# Altium schematic sheet USB.SchDoc
size A
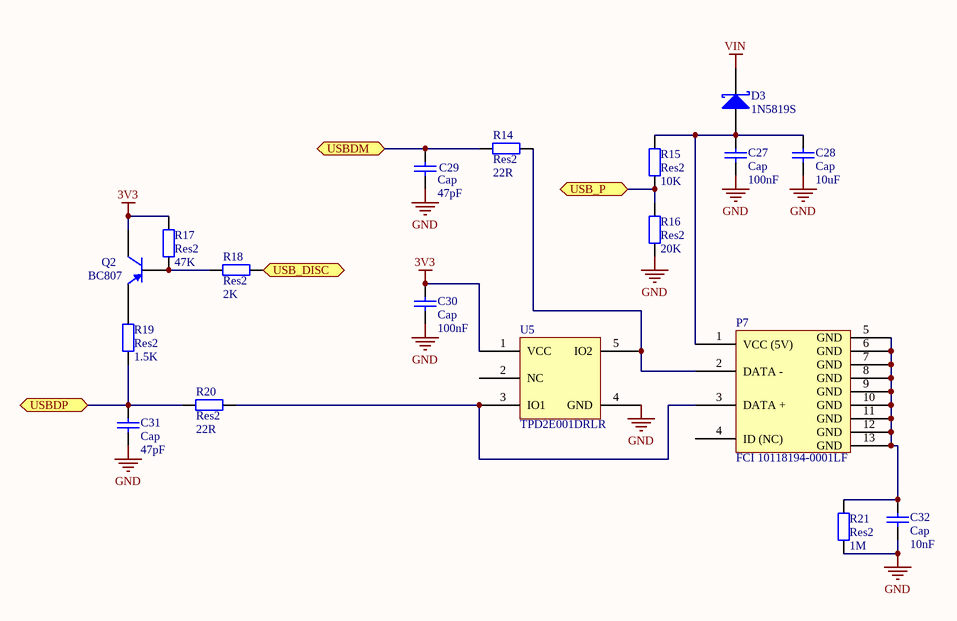
[diagram p0: USB.SchDoc]

## Parts
C27  Cap  value 100nF  [0603]
C28  Cap  value 10uF  [0805]
C29  Cap  value 47pF  [0603]
C30  Cap  value 100nF  [0603]
C31  Cap  value 47pF  [0603]
C32  Cap  value 10nF  [0603]
D3  1N5819S  [SMB]
P7  FCI 10118194-0001LF  [CONN USB MICRO B RECPT SMT R/A]
Q2  BC807  [SOT-23B_L]
R14  Res2  value 22R  [0603]
R15  Res2  value 10K  [0603]
R16  Res2  value 20K  [0603]
R17  Res2  value 47K  [0603]
R18  Res2  value 2K  [0603]
R19  Res2  value 1.5K  [0603]
R20  Res2  value 22R  [0603]
R21  Res2  value 1M  [0603]
U5  TPD2E001DRLR  [SOT-553]

## Ports
USB_DISC, USB_P, USBDM, USBDP

## Nets
3V3: C30.2 Q2.1(C) R17.1 U5.1(VCC)
GND: C27.1 C28.1 C29.1 C30.1 C31.1 C32.1 R16.1 R21.2 U5.4(GND)
VIN: D3.2(K)
USB_DISC: R18.2 ; port USB_DISC
USB_P: R15.1 R16.2 ; port USB_P
USBDM: C29.2 R14.2 ; port USBDM
USBDP: C31.2 R19.2 R20.2 ; port USBDP
NetC27_2: C27.2 C28.2 D3.1(A) P7.1(VCC_(5V)) R15.2
NetC32_2: C32.2 P7.5(GND) P7.6(GND) P7.7(GND) P7.8(GND) P7.9(GND) P7.10(GND) P7.11(GND) P7.12(GND) P7.13(GND) R21.1
NetP7_2: P7.2(DATA_-) R14.1 U5.5(IO2)
NetP7_3: P7.3(DATA_+) R20.1 U5.3(IO1)
NetQ2_2: Q2.2(B) R17.2 R18.1
NetQ2_3: Q2.3(E) R19.1

Not connected (* = marked no-connect by the designer): P7 4(ID_(NC)); U5 2(NC)

## Library data of the parts
C27 C28 C30 = Cap: Capacitor; Supplier 1: Digi-Key
  C27 C30: Supplier Part Number 1: 399-1095-1-ND
  C28: Supplier Part Number 1: 445-6857-1-ND
C29 C31 = Cap: Capacitor; Manufacturer: Samsung Electro-Mechanics America, Inc; Manufacturer Part Number: CL10C470JB8NCNC; Description: CAP CER 47PF 50V 5% NP0 0603; Tolerance: ±5%; Voltage - Rated: 50V; Temperature Coefficient: C0G, NP0; Supplier 1: Digi-Key; Supplier Part Number 1: 1276-2296-1-ND; RoHS: RoHS Compliant; Category: Capacitors; Stock 1: 191448; Pricing 1: 1=0.1, 10=0.029, 25=0.0204, 100=0.0132, 500=0.00924, 1000=0.0072 (USD); Packaging: Cut Tape (CT); Capacitance: 47pF; Mounting Type: Surface Mount, MLCC; Operating Temperature: -55°C ~ 125°C; Applications: General Purpose; Ratings: -; Package / Case: 0603 (1608 Metric); Size / Dimension: 0.063" L x 0.031" W (1.60mm x 0.80mm); Height - Seated (Max): -; Thickness (Max): 0.035" (0.90mm); Lead Spacing: -; Features: -; Lead Style: -; ComponentLink1URL: http://www.samsungsem.com/kr/front/downloadcms.do?path=/kr/support/product-search/mlcc/__icsFiles/afieldfile/2014/11/05&fileName=S_CL10C470JB8NCNC.pdf; ComponentLink1Description: http://www.samsungsem.com/kr/front/downloadcms.do?path=/kr/support/product-search/mlcc/__icsFiles/afieldfile/2014/11/05&fileName=S_CL10C470JB8NCNC.pdf
C32 = Cap: Capacitor; Manufacturer: Samsung Electro-Mechanics America, Inc; Manufacturer Part Number: CL10B103JB8NNNC; Description: CAP CER 10000PF 50V 5% X7R 0603; Capacitance: 10000pF; Tolerance: ±5%; Voltage - Rated: 50V; Temperature Coefficient: X7R; Supplier 1: Digi-Key; Supplier Part Number 1: 1276-1103-1-ND; RoHS: RoHS Compliant; Category: Capacitors; Stock 1: 65936; Pricing 1: 1=0.1, 10=0.036, 25=0.0256, 100=0.0165, 500=0.01156, 1000=0.009 (USD); Packaging: Cut Tape (CT); Mounting Type: Surface Mount, MLCC; Operating Temperature: -55°C ~ 125°C; Applications: General Purpose; Ratings: -; Package / Case: 0603 (1608 Metric); Size / Dimension: 0.063" L x 0.031" W (1.60mm x 0.80mm); Height - Seated (Max): -; Thickness (Max): 0.035" (0.90mm); Lead Spacing: -; Features: -; Lead Style: -; ComponentLink1URL: http://www.samsungsem.com/kr/front/downloadcms.do?path=/kr/support/product-search/mlcc/__icsFiles/afieldfile/2014/11/05&fileName=S_CL10B103JB8NNNC.pdf; ComponentLink1Description: http://www.samsungsem.com/kr/front/downloadcms.do?path=/kr/support/product-search/mlcc/__icsFiles/afieldfile/2014/11/05&fileName=S_CL10B103JB8NNNC.pdf
D3 = D Schottky: Schottky Diode; Manufacturer: Diodes Incorporated; Manufacturer Part Number: 1N5819HW-7-F; Description: DIODE SCHOTTKY 40V 1A SOD123; Voltage - DC Reverse (Vr) (Max): 40V; Current - Average Rectified (Io): 1A; Voltage - Forward (Vf) (Max) @ If: 450mV @ 1A; Speed: Fast Recovery =< 500ns, > 200mA (Io); Current - Reverse Leakage @ Vr: 1mA @ 40V; Capacitance @ Vr, F: 60pF @ 4V, 1MHz; Published: 8-Jun-2000; LatestRevisionDate: 17-Jul-2002; LatestRevisionNote: Re-released for DXP Platform.; PackageReference: SMB; Publisher: Altium Limited; PackageDescription: DO-214-AA/SMB; 2 C-Bend Leads; Body 5.3 x 3.6 mm, inc. leads (LxW); Code_JEDEC: DO-214-AA; Supplier 1: Digi-Key; Supplier Part Number 1: 1N5819HW-FDICT-ND; RoHS: RoHS Compliant; Category: Discrete Semiconductor Products; Stock 1: 628950; Pricing 1: 1=0.52, 10=0.371, 25=0.2884, 100=0.2184, 250=0.1544, 500=0.1236, 1000=0.0948 (USD); Packaging: Cut Tape (CT); Diode Type: Schottky; Reverse Recovery Time (trr): -; Mounting Type: Surface Mount; Package / Case: SOD-123; Supplier Device Package: SOD-123; Operating Temperature - Junction: -65°C ~ 125°C; ComponentLink1URL: http://www.diodes.com/datasheets/ds30217.pdf; ComponentLink1Description: http://www.diodes.com/datasheets/ds30217.pdf
P7 = FCI 10118194-0001LF: CONN USB MICRO B RECPT SMT R/A
Q2 = PNP: PNP Bipolar Transistor; Manufacturer: NXP Semiconductors; Manufacturer Part Number: BC807-40,215; Description: TRANS PNP 45V 0.5A SOT23; Current - Collector (Ic) (Max): 500mA; Voltage - Collector Emitter Breakdown (Max): 45V; Vce Saturation (Max) @ Ib, Ic: 700mV @ 50mA, 500mA; DC Current Gain (hFE) (Min) @ Ic, Vce: 250 @ 100mA, 1V; Power - Max: 250mW; Frequency - Transition: 80MHz; Published: 8-Jun-2000; LatestRevisionDate: 29-May-2009; LatestRevisionNote: IPC-7351 Footprint Added.; PackageVersion: Aug-1999; PackageReference: SOT-23B; Publisher: Altium Limited; PackageDescription: 3-Pin SOT-23 Package 0.95 mm Pitch, 2.4 mm Lead Span; Supplier 1: Digi-Key; Supplier Part Number 1: 568-1629-1-ND; RoHS: RoHS Compliant; Category: Discrete Semiconductor Products; Stock 1: 87848; Pricing 1: 1=0.15, 10=0.133, 25=0.1212, 100=0.0871, 250=0.05132, 500=0.04258, 1000=0.02905 (USD); Packaging: Cut Tape (CT); Transistor Type: PNP; Current - Collector Cutoff (Max): -; Mounting Type: Surface Mount; Package / Case: TO-236-3, SC-59, SOT-23-3; Supplier Device Package: SOT-23 (TO-236AB); ComponentLink1URL: http://www.nxp.com/documents/data_sheet/BC807_BC807W_BC327.pdf; ComponentLink1Description: http://www.nxp.com/documents/data_sheet/BC807_BC807W_BC327.pdf
R14 R20 = Res2: Resistor; Manufacturer: Panasonic Electronic Components; Manufacturer Part Number: ERJ-3EKF22R0V; Description: RES SMD 22 OHM 1% 1/10W 0603; Resistance (Ohms): 22; Tolerance: ±1%; Power (Watts): 0.1W, 1/10W; Temperature Coefficient: ±100ppm/°C; Supplier 1: Digi-Key; Supplier Part Number 1: P22.0HCT-ND; RoHS: RoHS Compliant; Category: Resistors; Stock 1: 210130; Pricing 1: 1=0.1, 50=0.015, 100=0.0114, 250=0.00844, 500=0.00624, 1000=0.00416, 2500=0.00351 (USD); Packaging: Cut Tape (CT); Composition: Thick Film; Features: Automotive AEC-Q200; Operating Temperature: -55°C ~ 155°C; Package / Case: 0603 (1608 Metric); Supplier Device Package: 0603; Size / Dimension: 0.063" L x 0.031" W (1.60mm x 0.80mm); Height: 0.022" (0.55mm); Number of Terminations: 2; ComponentLink1URL: http://industrial.panasonic.com/www-cgi/jvcr13pz.cgi?E+PZ+3+AOA0002+ERJ3EKF22R0V+7+WW; ComponentLink1Description: http://industrial.panasonic.com/www-cgi/jvcr13pz.cgi?E+PZ+3+AOA0002+ERJ3EKF22R0V+7+WW
R15 = Res2: Resistor; Manufacturer: Panasonic Electronic Components; Manufacturer Part Number: ERJ-3GEYJ103V; Description: RES SMD 10K OHM 5% 1/10W 0603; Tolerance: ±5%; Power (Watts): 0.1W, 1/10W; Temperature Coefficient: ±200ppm/°C; Supplier 1: Digi-Key; Supplier Part Number 1: P10KGCT-ND; RoHS: RoHS Compliant; Category: Resistors; Stock 1: 3887859; Pricing 1: 1=0.1, 50=0.0126, 100=0.0096, 250=0.00716, 500=0.00528, 1000=0.00352, 2500=0.00297 (USD); Packaging: Cut Tape (CT); Resistance (Ohms): 10k; Composition: Thick Film; Features: Automotive AEC-Q200; Operating Temperature: -55°C ~ 155°C; Package / Case: 0603 (1608 Metric); Supplier Device Package: 0603; Size / Dimension: 0.063" L x 0.031" W (1.60mm x 0.80mm); Height: 0.022" (0.55mm); Number of Terminations: 2; ComponentLink1URL: http://industrial.panasonic.com/www-cgi/jvcr13pz.cgi?E+PZ+3+AOA0001+ERJ3GEYJ103V+7+WW; ComponentLink1Description: http://industrial.panasonic.com/www-cgi/jvcr13pz.cgi?E+PZ+3+AOA0001+ERJ3GEYJ103V+7+WW
R16 = Res2: Resistor; Manufacturer: Samsung Electro-Mechanics America, Inc; Manufacturer Part Number: RC1608F203CS; Description: RES SMD 20K OHM 1% 1/10W 0603; Tolerance: ±1%; Power (Watts): 0.1W, 1/10W; Temperature Coefficient: ±100ppm/°C; Supplier 1: Digi-Key; Supplier Part Number 1: 1276-4768-1-ND; RoHS: RoHS Compliant; Category: Resistors; Stock 1: 9626; Pricing 1: 1=0.1, 10=0.011, 25=0.0084, 100=0.0047, 500=0.00286, 1000=0.0021, 2500=0.00182 (USD); Packaging: Cut Tape (CT); Resistance (Ohms): 20k; Composition: Thick Film; Features: -; Operating Temperature: -55°C ~ 155°C; Package / Case: 0603 (1608 Metric); Supplier Device Package: 0603 (1608 Metric); Size / Dimension: 0.063" L x 0.031" W (1.60mm x 0.80mm); Height: 0.022" (0.55mm); Number of Terminations: 2; ComponentLink1URL: http://www.samsungsem.com/global/support/library/product-catalog/__icsFiles/afieldfile/2015/01/12/CHIP_RESISTOR_150112_1.pdf; ComponentLink1Description: http://www.samsungsem.com/global/support/library/product-catalog/__icsFiles/afieldfile/2015/01/12/CHIP_RESISTOR_150112_1.pdf
R17 = Res2: Resistor; Manufacturer: Samsung Electro-Mechanics America, Inc; Manufacturer Part Number: RC1608F473CS; Description: RES SMD 47K OHM 1% 1/10W 0603; Tolerance: ±1%; Power (Watts): 0.1W, 1/10W; Temperature Coefficient: ±100ppm/°C; Supplier 1: Digi-Key; Supplier Part Number 1: 1276-4808-1-ND; RoHS: RoHS Compliant; Category: Resistors; Stock 1: 3886; Pricing 1: 1=0.1, 10=0.011, 25=0.0084, 100=0.0047, 500=0.00286, 1000=0.0021, 2500=0.00182 (USD); Packaging: Cut Tape (CT); Resistance (Ohms): 47k; Composition: Thick Film; Features: -; Operating Temperature: -55°C ~ 155°C; Package / Case: 0603 (1608 Metric); Supplier Device Package: 0603 (1608 Metric); Size / Dimension: 0.063" L x 0.031" W (1.60mm x 0.80mm); Height: 0.022" (0.55mm); Number of Terminations: 2; ComponentLink1URL: http://www.samsungsem.com/global/support/library/product-catalog/__icsFiles/afieldfile/2015/01/12/CHIP_RESISTOR_150112_1.pdf; ComponentLink1Description: http://www.samsungsem.com/global/support/library/product-catalog/__icsFiles/afieldfile/2015/01/12/CHIP_RESISTOR_150112_1.pdf
R18 = Res2: Resistor; Manufacturer: Samsung Electro-Mechanics America, Inc; Manufacturer Part Number: RC1608F202CS; Description: RES SMD 2K OHM 1% 1/10W 0603; Tolerance: ±1%; Power (Watts): 0.1W, 1/10W; Temperature Coefficient: ±100ppm/°C; Supplier 1: Digi-Key; Supplier Part Number 1: 1276-3495-1-ND; RoHS: RoHS Compliant; Category: Resistors; Stock 1: 2703; Pricing 1: 1=0.1, 10=0.011, 25=0.0084, 100=0.0047, 500=0.00286, 1000=0.0021, 2500=0.00182 (USD); Packaging: Cut Tape (CT); Resistance (Ohms): 2k; Composition: Thick Film; Features: -; Operating Temperature: -55°C ~ 155°C; Package / Case: 0603 (1608 Metric); Supplier Device Package: 0603 (1608 Metric); Size / Dimension: 0.063" L x 0.031" W (1.60mm x 0.80mm); Height: 0.022" (0.55mm); Number of Terminations: 2; ComponentLink1URL: http://www.samsungsem.com/global/support/library/product-catalog/__icsFiles/afieldfile/2015/01/12/CHIP_RESISTOR_150112_1.pdf; ComponentLink1Description: http://www.samsungsem.com/global/support/library/product-catalog/__icsFiles/afieldfile/2015/01/12/CHIP_RESISTOR_150112_1.pdf
R19 = Res2: Resistor; Manufacturer: Samsung Electro-Mechanics America, Inc; Manufacturer Part Number: RC1608F152CS; Description: RES SMD 1.5K OHM 1% 1/10W 0603; Tolerance: ±1%; Power (Watts): 0.1W, 1/10W; Temperature Coefficient: ±100ppm/°C; Supplier 1: Digi-Key; Supplier Part Number 1: 1276-4660-1-ND; RoHS: RoHS Compliant; Category: Resistors; Stock 1: 40182; Pricing 1: 1=0.1, 10=0.011, 25=0.0084, 100=0.0047, 500=0.00286, 1000=0.0021, 2500=0.00182 (USD); Packaging: Cut Tape (CT); Resistance (Ohms): 1.5k; Composition: Thick Film; Features: -; Operating Temperature: -55°C ~ 155°C; Package / Case: 0603 (1608 Metric); Supplier Device Package: 0603 (1608 Metric); Size / Dimension: 0.063" L x 0.031" W (1.60mm x 0.80mm); Height: 0.022" (0.55mm); Number of Terminations: 2; ComponentLink1URL: http://www.samsungsem.com/global/support/library/product-catalog/__icsFiles/afieldfile/2015/01/12/CHIP_RESISTOR_150112_1.pdf; ComponentLink1Description: http://www.samsungsem.com/global/support/library/product-catalog/__icsFiles/afieldfile/2015/01/12/CHIP_RESISTOR_150112_1.pdf
R21 = Res2: Resistor; Manufacturer: Yageo; Manufacturer Part Number: RC0603FR-071ML; Description: RES SMD 1M OHM 1% 1/10W 0603; Tolerance: ±1%; Power (Watts): 0.1W, 1/10W; Temperature Coefficient: ±100ppm/°C; Supplier 1: Digi-Key; Supplier Part Number 1: 311-1.00MHRCT-ND; RoHS: RoHS Compliant; Category: Resistors; Stock 1: 2145720; Pricing 1: 1=0.1, 10=0.015, 25=0.0108, 100=0.006, 250=0.00456, 500=0.00364, 1000=0.00268, 2500=0.00233 (USD); Packaging: Cut Tape (CT); Resistance (Ohms): 1M; Composition: Thick Film; Features: Moisture Resistant; Operating Temperature: -55°C ~ 155°C; Package / Case: 0603 (1608 Metric); Supplier Device Package: 0603; Size / Dimension: 0.063" L x 0.031" W (1.60mm x 0.80mm); Height: 0.022" (0.55mm); Number of Terminations: 2; ComponentLink1URL: http://www.yageo.com/documents/recent/PYu-RC_Group_51_RoHS_L_1.pdf; ComponentLink1Description: http://www.yageo.com/documents/recent/PYu-RC_Group_51_RoHS_L_1.pdf
U5 = TPD2E001DRLR: TVS DIODE 5.5VWM 100VC SOT5; Manufacturer: Texas Instruments; Bidirectional Channels: 2; Voltage - Reverse Standoff (Typ): 5.5V (Max); Voltage - Breakdown (Min): 11V; Voltage - Clamping (Max) @ Ipp: 100V; Power Line Protection: Yes; Supplier 1: Digi-Key; Supplier Part Number 1: 296-21883-1-ND; Manufacturer Part Number: TPD2E001DRLR; RoHS: RoHS Compliant; Category: Circuit Protection; Stock 1: 66831; Pricing 1: 1=0.63, 10=0.527, 25=0.462, 100=0.3955, 250=0.34304, 500=0.29056, 750=0.25088, 1000=0.224 (USD); Packaging: Cut Tape (CT); Type: Steering (Rail to Rail); Unidirectional Channels: -; Current - Peak Pulse (10/1000µs): -; Power - Peak Pulse: -; Applications: General Purpose; Capacitance @ Frequency: -; Operating Temperature: -40°C ~ 85°C (TA); Mounting Type: Surface Mount; Package / Case: SOT-553; Supplier Device Package: 5-SOT; ComponentLink1URL: http://www.ti.com/lit/ds/symlink/tpd2e001.pdf; ComponentLink1Description: http://www.ti.com/lit/ds/symlink/tpd2e001.pdf